# EAGLE schematic schematic (EAGLE 9.7.0)
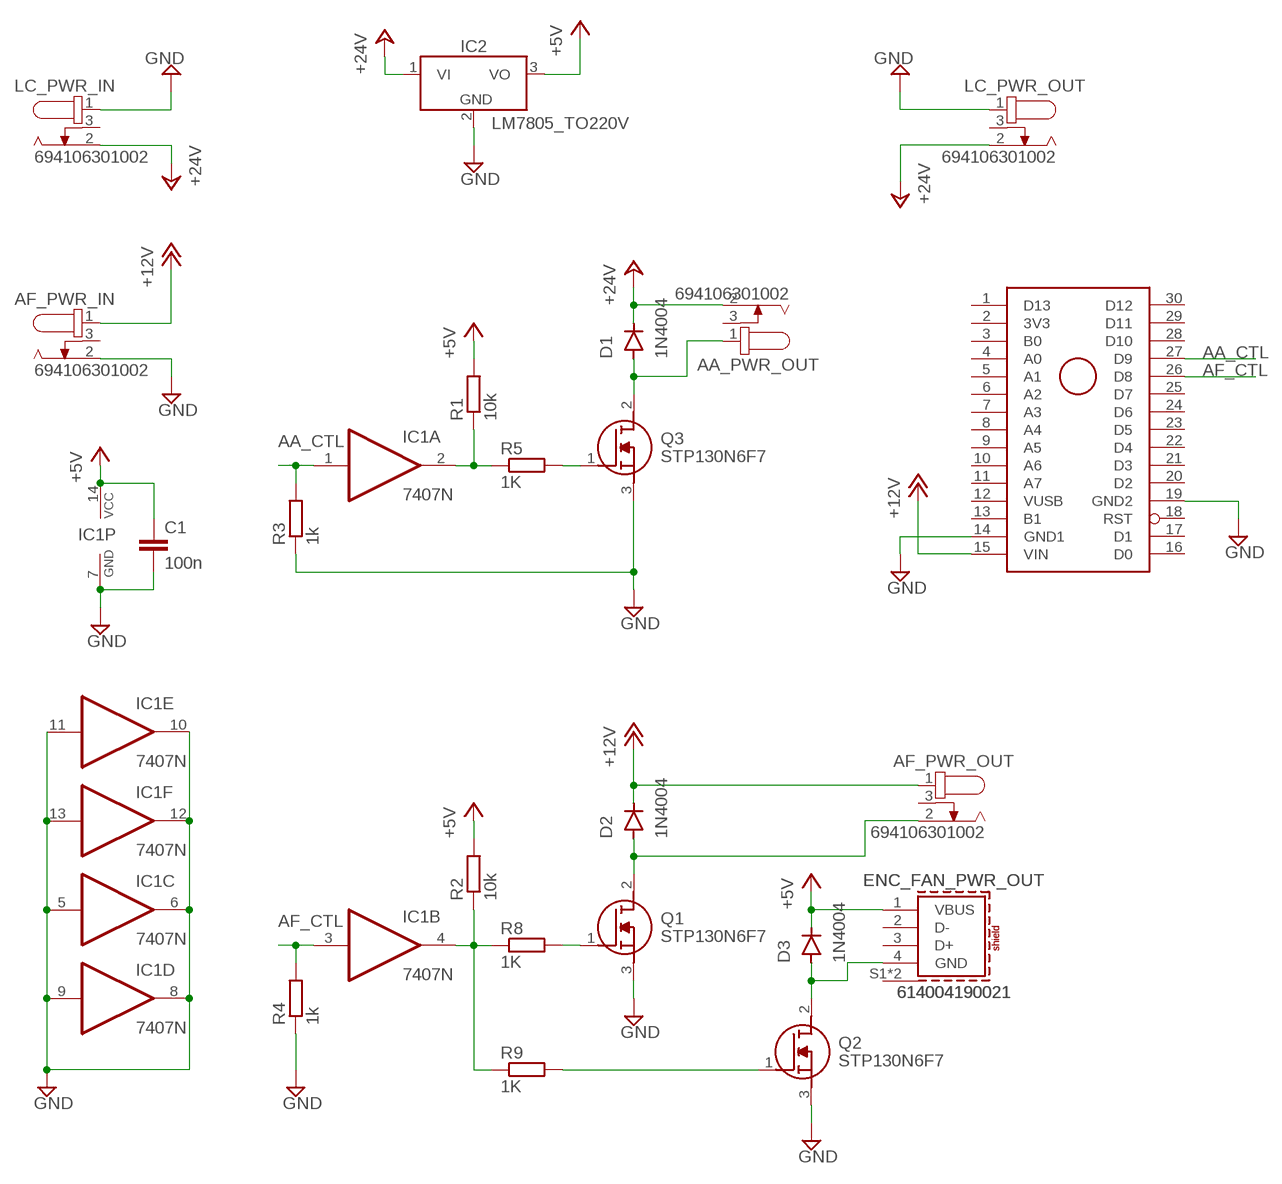
[diagram p0: schematic, sheet 1]

## Parts
AA_PWR_OUT  694106301002  694106301002  [694106301002]
AF_PWR_IN  694106301002  694106301002  [694106301002]
AF_PWR_OUT  694106301002  694106301002  [694106301002]
C1  100n  C-EU050-024X044  [C050-024X044]
D1  1N4004  [DO-41]
D2  1N4004  [DO-41]
D3  1N4004  [DO-41]
ENC_FAN_PWR_OUT  614004190021  [614004190021]
IC1  7407N  [DIL14]
IC2  LM7805_TO220V  [TO220V]
LC_PWR_IN  694106301002  694106301002  [694106301002]
LC_PWR_OUT  694106301002  694106301002  [694106301002]
Q1  STP130N6F7  [TO255P460X1020X2008-3P]
Q2  STP130N6F7  [TO255P460X1020X2008-3P]
Q3  STP130N6F7  [TO255P460X1020X2008-3P]
R1  10k  R-EU_0204/7  [0204/7]
R2  10k  R-EU_0204/7  [0204/7]
R3  1k  R-EU_0204/7  [0204/7]
R4  1k  R-EU_0204/7  [0204/7]
R5  1K  R-EU_0204/7  [0204/7]
R8  1K  R-EU_0204/7  [0204/7]
R9  1K  R-EU_0204/7  [0204/7]
U$1  ARDUINO_NANO_ESP32  [ARDUINO_NANO_ESP32_ON_HEADERS]

## Nets
+5V [5V]: C1.1 D3.C ENC_FAN_PWR_OUT.1(VBUS) IC1.14(P:VCC) IC2.3(VO) R1.2 R2.2
+12V [12V]: AF_PWR_IN.1 AF_PWR_OUT.1 D2.C U$1.15(VIN)
+24V [24V]: AA_PWR_OUT.2 D1.C IC2.1(VI) LC_PWR_IN.2 LC_PWR_OUT.2
AA_CTL: IC1.1(A:I) R3.2 U$1.27(D9)
AF_CTL: IC1.3(B:I) R4.2 U$1.26(D8)
GND: AF_PWR_IN.2 C1.2 IC1.5(C:I) IC1.6(C:O) IC1.7(P:GND) IC1.8(D:O) IC1.9(D:I) IC1.10(E:O) IC1.11(E:I) IC1.12(F:O) IC1.13(F:I) IC2.2(GND) LC_PWR_IN.1 LC_PWR_OUT.1 Q1.3(S) Q2.3(S) Q3.3(S) R3.1 R4.1 U$1.14(GND1) U$1.19(GND2)
N$1 [12V]: AF_PWR_OUT.2 D2.A Q1.2(D)
N$2: Q2.1(G) R9.2
N$3: IC1.2(A:O) R1.1 R5.1
N$4: Q1.1(G) R8.2
N$5: Q3.1(G) R5.2
N$8 [5V]: D3.A ENC_FAN_PWR_OUT.4(GND) Q2.2(D)
N$9: IC1.4(B:O) R2.1 R8.1 R9.1
N$10 [24V]: AA_PWR_OUT.1 D1.A Q3.2(D)
Unconnected: AA_PWR_OUT.3 AF_PWR_IN.3 AF_PWR_OUT.3 ENC_FAN_PWR_OUT.2(D-) ENC_FAN_PWR_OUT.3(D+) ENC_FAN_PWR_OUT.S1(SHIELD) ENC_FAN_PWR_OUT.S2(SHIELD) LC_PWR_IN.3 LC_PWR_OUT.3 U$1.1(D13) U$1.2(3V3) U$1.3(B0) U$1.4(A0) U$1.5(A1) U$1.6(A2) U$1.7(A3) U$1.8(A4) U$1.9(A5) U$1.10(A6) U$1.11(A7) U$1.12(VUSB) U$1.13(B1) U$1.16(D0) U$1.17(D1) U$1.18(RST) U$1.20(D2) U$1.21(D3) U$1.22(D4) U$1.23(D5) U$1.24(D6) U$1.25(D7) U$1.28(D10) U$1.29(D11) U$1.30(D12)

## Library data of the parts
AA_PWR_OUT AF_PWR_IN AF_PWR_OUT LC_PWR_IN LC_PWR_OUT = Wurth_Connectors_WR-DC:694106301002: WR-DC DC Power Jack Right Angled (6.4) KIND PROPERTIES Quality Class 5 000 Mating cycles Type Right Angled MATERIAL PROPERTIES Insulator Material PA66 Insulator Flammability Rating UL94 V-0 Color Black Contact Material Copper Alloy Contact Type Stamped Center Pin Plating Gold Center Pin Terminal Plating Tin Tip Spring Material Tin Shunt Terminal Plating Tin GENERAL INFORMATION Operating Temperature -40 up to +85 °C Compliance RoHS ELECTRICAL PROPERTIES IR 1 5 A Working Voltage 30 V (AC) Withstanding Voltage 500 V (AC) Contact Resistance 50 mΩ RISO 100 MΩ PACKAGING PROPERTIES Packaging Bag <https://www.we-online.com/catalog/media/o59009v209%20Family_WR-DC_DC_Power_Jack_Right_Angled_THT_69410x301002.jpg> Details see: https://www.we-online.com/catalog/en/DC_RIGHT_ANGLED_6_4_69410X301002 Updated by Ella Wu 2021-09-30 2021(C) Wurth Elektronik; DATASHEET-URL: https://www.we-online.com/catalog/datasheet/694106301002.pdf; IR: 5A; MOUNT: THT; PART-NUMBER: 694106301002; TYPE: Right Angled; WORKING-VOLTAGE: 30V(AC)
C1 = MyComponentsFusion:C-EU: CAPACITOR, European symbol
D1-D3 = MyComponentsFusion:1N4004: DIODE GEN PURP 400V 1A DO41 Manufacturer's datasheet <https://www.mccsemi.com/pdf/Products/1N4001-1N4007(DO-41).pdf>; CREATED_BY: PCBLayout.com; DIGIKEY_PART_NUMBER: 1N4004MSCT-ND; MANUFACTURER: Micro Commercial Co; MPN: 1N4004; PACKAGE: DO-41
ENC_FAN_PWR_OUT = Wurth_Connectors_WR-USB:614004190021: WR-COM USB 2.0 Type A Horizontal THT Kind Properties Durability:1 500 Mating cycles Quality Class:1 500 Mating cycles Connector Type:USB Gender:Receptacle Type:Horizontal General Information Operating Temperature:-40up to +85 °C Compliance:RoHS Electrical Properties IR 1:3A Working Voltage:30V (AC) Withstanding Voltage:500 V (AC) Contact Resistance:30 mΩ Material Properties Insulator Material:PBT Insulator Flammability Rating:UL94 V-0 Color:White Cover Material:Brass Cover Plating:Nickel Contact Material:Brass Contact Plating:Gold Contact Type:Stamped <https://www.we-online.com/catalog/media/o58996v209%20Family_WR-COM_614004190021_4C.jpg> Details see: https://www.we-online.com/catalog/en/COM_2_0_THT_TYPE_A_HORIZONTAL/ Updated by Yingchun, Shan 2020-01-14 2020 (C) Würth Elektronik; APPLICATION: USB 2.0; DATASHEET-URL: https://www.we-online.com/redexpert/spec/614004190021?ae; GERDER: Receptacle; INTERFACE-TYPE: Type A; IR: 3.0A; MOUNT: THT; PACKAGING: Tray; PART-NUMBER: 614004190021; PINS: 4; TYPE: Horizontal; WORKING-VOLTAGE: 30V(AC)
IC1 = MyComponentsFusion:74*07: Hex BUFFER, open collector high-voltage output
IC2 = IC_Power-Management:LM7805: 5V Voltage Regulator Reference Datasheet <https://www.ti.com/lit/ds/symlink/lm340.pdf>; CATEGORY: IC_Linear; DESCRIPTION: 5V Voltage Regulator; MANUFACTURER: Generic; MPN: Generic; SERIES: LM7805; SUB-CATEGORY: Voltage Regulator; TYPE: 5V
Q1-Q3 = SamacSys_Parts:STP130N6F7: N-channel 60 V, 4.2 mOhm typ., 80 A STripFET F7 Power MOSFET in TO-220 package Source: Datasheet <https://www.st.com/resource/en/datasheet/stp130n6f7.pdf>; ARROW_PART_NUMBER: STP130N6F7; ARROW_PRICE-STOCK: https://www.arrow.com/en/products/stp130n6f7/stmicroelectronics?region=nac; DESCRIPTION: N-channel 60 V, 4.2 mOhm typ., 80 A STripFET F7 Power MOSFET in TO-220 package; HEIGHT: 4.6mm; MANUFACTURER_NAME: STMicroelectronics; MANUFACTURER_PART_NUMBER: STP130N6F7; MOUSER_PART_NUMBER: 511-STP130N6F7; MOUSER_PRICE-STOCK: https://www.mouser.co.uk/ProductDetail/STMicroelectronics/STP130N6F7?qs=bKenfurwlsnAlTA32qCHLw%3D%3D
R1-R5 R8 R9 = MyComponentsFusion:R-EU_: RESISTOR, European symbol
U$1 = MyComponentsFusion:ARDUINO_NANO_ESP32: Arduino Nano ESP32 For use when the intention is to plug an existing Arduino Nano ESP32 board with headers into sockets soldered to the PCB.

## Net classes
0 default: width 0.254 mm, drill 0.254 mm, clearance 0.254 mm
2 24V: width 2.54 mm, drill 2.54 mm, clearance 0.254 mm to class 0, clearance 0.254 mm to class 1, clearance 2.794 mm
3 5V: width 0.254 mm, drill 0.254 mm, clearance 0.254 mm to class 0, clearance 0.254 mm to class 1, clearance 0.254 mm to class 2, clearance 0.254 mm
4 12V: width 1.27 mm, drill 1.27 mm, clearance 0.254 mm to class 0, clearance 0.254 mm to class 1, clearance 0.254 mm to class 2, clearance 0.254 mm to class 3, clearance 1.27 mm